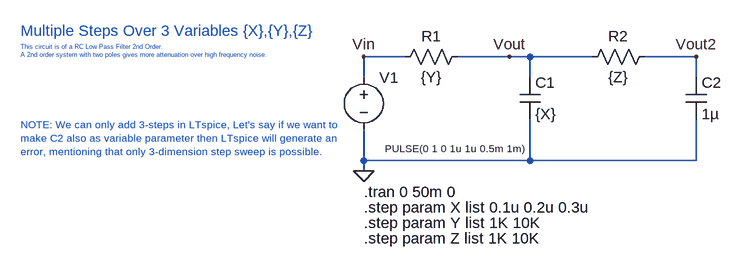
[diagram p0: schematic 03-Sweep Parameter_2ndOrderRCFilter.asc]
03-Sweep Parameter_2ndOrderRCFilter.asc, the LTspice schematic file:
Version 4
SHEET 1 880 680
WIRE 128 96 64 96
WIRE 288 96 208 96
WIRE 320 96 288 96
WIRE 416 96 320 96
WIRE 576 96 496 96
WIRE 64 128 64 96
WIRE 320 128 320 96
WIRE 576 128 576 96
WIRE 64 256 64 208
WIRE 320 256 320 192
WIRE 320 256 64 256
WIRE 576 256 576 192
WIRE 576 256 320 256
WIRE 64 272 64 256
FLAG 64 96 Vin
FLAG 288 96 Vout
FLAG 64 272 0
FLAG 576 96 Vout2
SYMBOL voltage 64 112 R0
WINDOW 3 244 125 Right 1
WINDOW 123 0 0 Left 0
WINDOW 39 0 0 Left 0
SYMATTR Value PULSE(0 1 0 1u 1u 0.5m 1m)
SYMATTR InstName V1
SYMBOL res 224 80 R90
WINDOW 0 0 56 VBottom 2
WINDOW 3 32 56 VTop 2
SYMATTR InstName R1
SYMATTR Value {Y}
SYMBOL cap 304 128 R0
SYMATTR InstName C1
SYMATTR Value {X}
SYMBOL res 512 80 R90
WINDOW 0 0 56 VBottom 2
WINDOW 3 32 56 VTop 2
SYMATTR InstName R2
SYMATTR Value {Z}
SYMBOL cap 560 128 R0
SYMATTR InstName C2
SYMATTR Value 1µ
TEXT 64 304 Left 2 !.tran 0 50m 0
TEXT 64 328 Left 2 !.step param X list 0.1u 0.2u 0.3u
TEXT 64 352 Left 2 !.step param Y list 1K 10K
TEXT 64 376 Left 2 !.step param Z list 1K 10K
TEXT -464 56 Left 2 ;Multiple Steps Over 3 Variables {X},{Y},{Z}
TEXT -464 80 Left 0 ;This circuit is of a RC Low Pass Filter 2nd Order.\nA 2nd order system with two poles gives more attenuation over high frequency noise.
TEXT -464 200 Left 1 ;NOTE: We can only add 3-steps in LTspice, Let's say if we want to\nmake C2 also as variable parameter then LTspice will generate an\nerror, mentioning that only 3-dimension step sweep is possible.

The netlist it stands for:
* 03-Sweep Parameter_2ndOrderRCFilter.asc
V1 Vin 0 PULSE(0 1 0 1u 1u 0.5m 1m)
R1 Vout Vin {Y}
C1 Vout 0 {X}
R2 Vout2 Vout {Z}
C2 Vout2 0 1µ
.tran 0 50m 0
.step param X list 0.1u 0.2u 0.3u
.step param Y list 1K 10K
.step param Z list 1K 10K
* Multiple Steps Over 3 Variables {X},{Y},{Z}
* This circuit is of a RC Low Pass Filter 2nd Order.
* A 2nd order system with two poles gives more attenuation over high frequency noise.
* NOTE: We can only add 3-steps in LTspice, Let's say if we want to
* make C2 also as variable parameter then LTspice will generate an
* error, mentioning that only 3-dimension step sweep is possible.
.backanno
.end